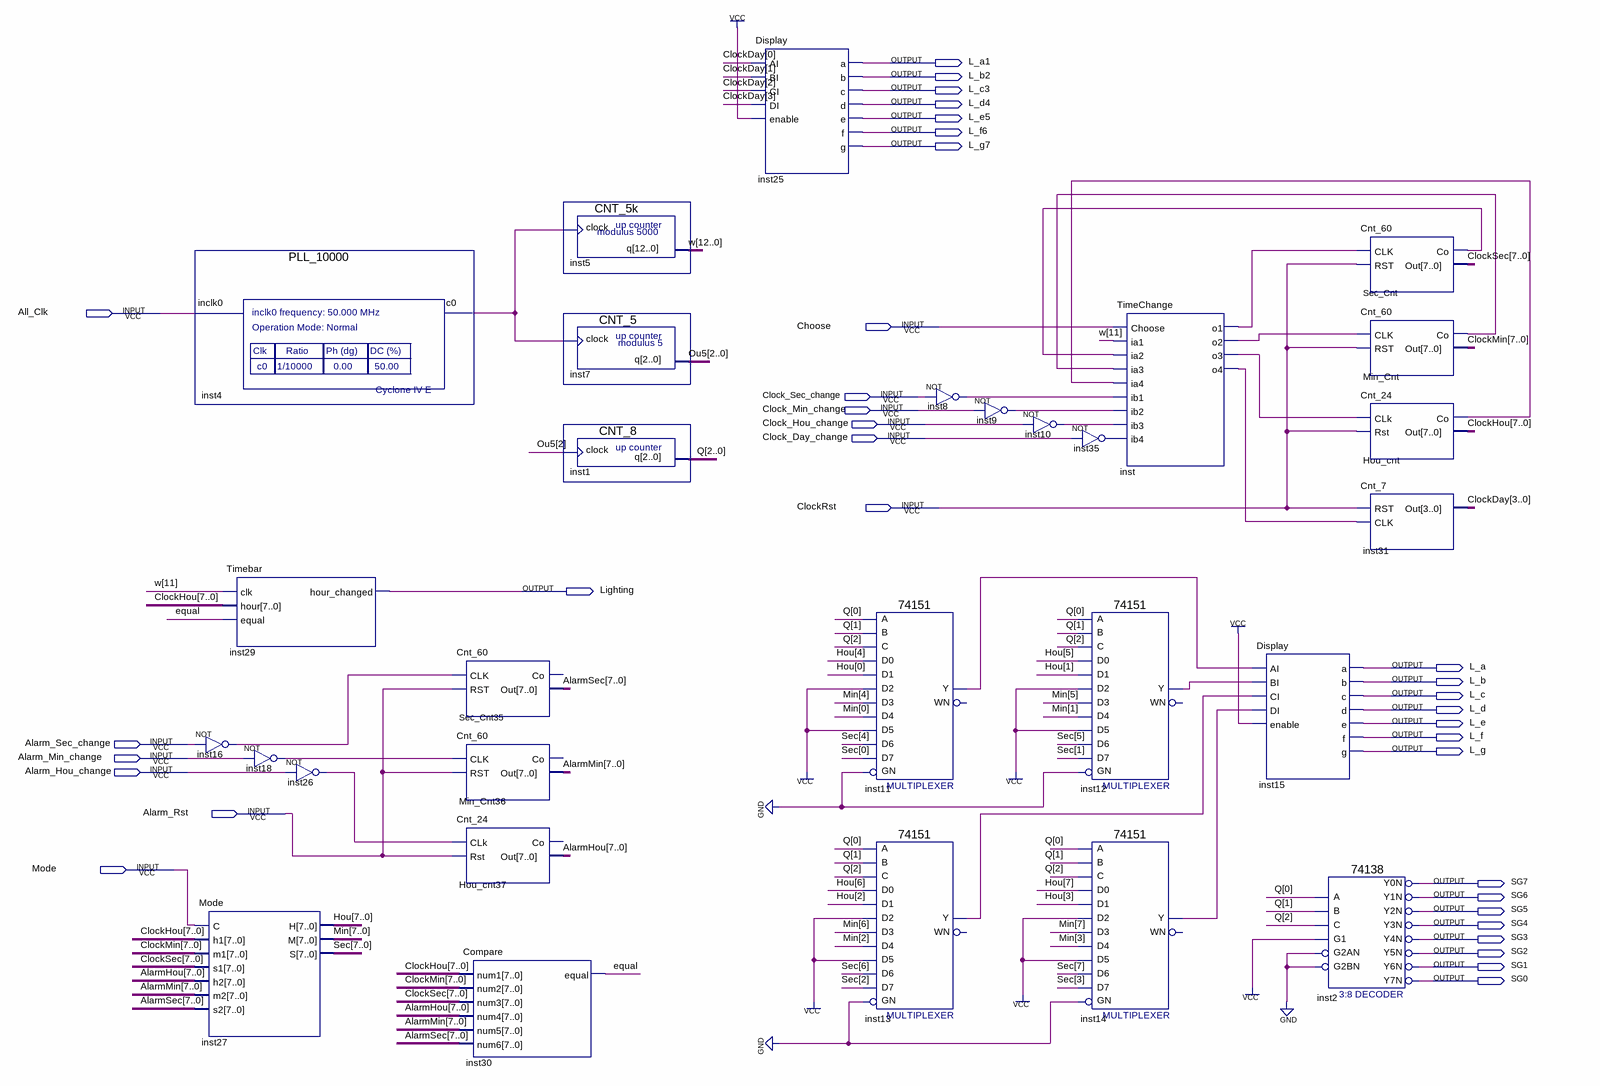
[diagram p0: schematic sheet]
// Quartus schematic Main.bdf as structural Verilog: 29 symbols, 35 pins
module Main (
  input  All_Clk,
  input  Choose,
  input  Clock_Sec_change,
  input  Clock_Min_change,
  input  Clock_Hou_change,
  input  Clock_Day_change,
  input  ClockRst,
  input  Alarm_Sec_change,
  input  Alarm_Min_change,
  input  Alarm_Hou_change,
  input  Alarm_Rst,
  input  Mode,
  output L_a1,
  output L_b2,
  output L_c3,
  output L_d4,
  output L_e5,
  output L_f6,
  output L_g7,
  output Lighting,
  output L_a,
  output L_b,
  output L_c,
  output L_d,
  output L_e,
  output L_f,
  output L_g,
  output SG7,
  output SG6,
  output SG5,
  output SG4,
  output SG3,
  output SG2,
  output SG1,
  output SG0
);

  wire equal, Hou_cnt_co, inst4_c0, inst8_out, inst9_out, inst10_out, inst11_y, inst12_y, inst13_y, inst14_y,
       inst16_out, inst18_out, inst26_out, inst35_out, inst_o1, inst_o2, inst_o3, inst_o4, Min_Cnt_co,
       Sec_Cnt_co;
  wire [2:0] Ou5, Q;
  wire [3:0] ClockDay;
  wire [7:0] AlarmHou, AlarmMin, AlarmSec, ClockHou, ClockMin, ClockSec, Hou, Min, Sec;
  wire [12:0] w;

  PLL_10000 inst4 (.inclk0(All_Clk), .c0(inst4_c0));
  not inst16 (inst16_out, Alarm_Sec_change);
  Mode inst27 (
    .C(Mode), .h1(ClockHou), .m1(ClockMin), .s1(ClockSec), .h2(AlarmHou), .m2(AlarmMin), .s2(AlarmSec),
    .H(Hou), .M(Min), .S(Sec));
  Timebar inst29 (.clk(w[11]), .hour(ClockHou), .equal(equal), .hour_changed(Lighting));
  not inst18 (inst18_out, Alarm_Min_change);
  not inst26 (inst26_out, Alarm_Hou_change);
  Cnt_60 Sec_Cnt35 (.CLK(inst16_out), .RST(Alarm_Rst), .Out(AlarmSec));  // open: Co
  Cnt_60 Min_Cnt36 (.CLK(inst18_out), .RST(Alarm_Rst), .Out(AlarmMin));  // open: Co
  Cnt_24 Hou_cnt37 (.CLk(inst26_out), .Rst(Alarm_Rst), .Out(AlarmHou));  // open: Co
  Compare inst30 (
    .num1(ClockHou), .num2(ClockMin), .num3(ClockSec), .num4(AlarmHou), .num5(AlarmMin), .num6(AlarmSec),
    .equal(equal));
  CNT_5k inst5 (.clock(inst4_c0), .q(w));
  CNT_5 inst7 (.clock(inst4_c0), .q(Ou5));
  CNT_8 inst1 (.clock(Ou5[2]), .q(Q));
  Display inst25 (
    .AI(ClockDay[0]), .BI(ClockDay[1]), .CI(ClockDay[2]), .DI(ClockDay[3]), .enable(1'b1), .a(L_a1),
    .b(L_b2), .c(L_c3), .d(L_d4), .e(L_e5), .f(L_f6), .g(L_g7));
  \74151  inst11 (
    .GN(1'b0), .C(Q[2]), .B(Q[1]), .A(Q[0]), .D5(1'b1), .D0(Hou[4]), .D1(Hou[0]), .D4(Min[0]), .D3(Min[4]),
    .D2(1'b1), .D6(Sec[4]), .D7(Sec[0]), .Y(inst11_y));  // open: WN
  \74151  inst13 (
    .GN(1'b0), .C(Q[2]), .B(Q[1]), .A(Q[0]), .D5(1'b1), .D0(Hou[6]), .D1(Hou[2]), .D4(Min[2]), .D3(Min[6]),
    .D2(1'b1), .D6(Sec[6]), .D7(Sec[2]), .Y(inst13_y));  // open: WN
  not inst8 (inst8_out, Clock_Sec_change);
  not inst9 (inst9_out, Clock_Min_change);
  not inst10 (inst10_out, Clock_Hou_change);
  not inst35 (inst35_out, Clock_Day_change);
  \74151  inst12 (
    .GN(1'b0), .C(Q[2]), .B(Q[1]), .A(Q[0]), .D5(1'b1), .D0(Hou[5]), .D1(Hou[1]), .D4(Min[1]), .D3(Min[5]),
    .D2(1'b1), .D6(Sec[5]), .D7(Sec[1]), .Y(inst12_y));  // open: WN
  \74151  inst14 (
    .GN(1'b0), .C(Q[2]), .B(Q[1]), .A(Q[0]), .D5(1'b1), .D0(Hou[7]), .D1(Hou[3]), .D4(Min[3]), .D3(Min[7]),
    .D2(1'b1), .D6(Sec[7]), .D7(Sec[3]), .Y(inst14_y));  // open: WN
  TimeChange inst (
    .Choose(Choose), .ia1(w[11]), .ia2(Sec_Cnt_co), .ia3(Min_Cnt_co), .ia4(Hou_cnt_co), .ib1(inst8_out),
    .ib2(inst9_out), .ib3(inst10_out), .ib4(inst35_out), .o1(inst_o1), .o2(inst_o2), .o3(inst_o3),
    .o4(inst_o4));
  Display inst15 (
    .AI(inst11_y), .BI(inst12_y), .CI(inst13_y), .DI(inst14_y), .enable(1'b1), .a(L_a), .b(L_b), .c(L_c),
    .d(L_d), .e(L_e), .f(L_f), .g(L_g));
  \74138  inst2 (
    .A(Q[0]), .B(Q[1]), .G1(1'b1), .C(Q[2]), .G2AN(1'b0), .G2BN(1'b0), .Y0N(SG7), .Y1N(SG6), .Y2N(SG5),
    .Y3N(SG4), .Y4N(SG3), .Y5N(SG2), .Y6N(SG1), .Y7N(SG0));
  Cnt_60 Sec_Cnt (.CLK(inst_o1), .RST(ClockRst), .Co(Sec_Cnt_co), .Out(ClockSec));
  Cnt_60 Min_Cnt (.CLK(inst_o2), .RST(ClockRst), .Co(Min_Cnt_co), .Out(ClockMin));
  Cnt_24 Hou_cnt (.CLk(inst_o3), .Rst(ClockRst), .Co(Hou_cnt_co), .Out(ClockHou));
  Cnt_7 inst31 (.RST(ClockRst), .CLK(inst_o4), .Out(ClockDay));
endmodule
